# Altium project MM08-FPS-400.PrjPcb
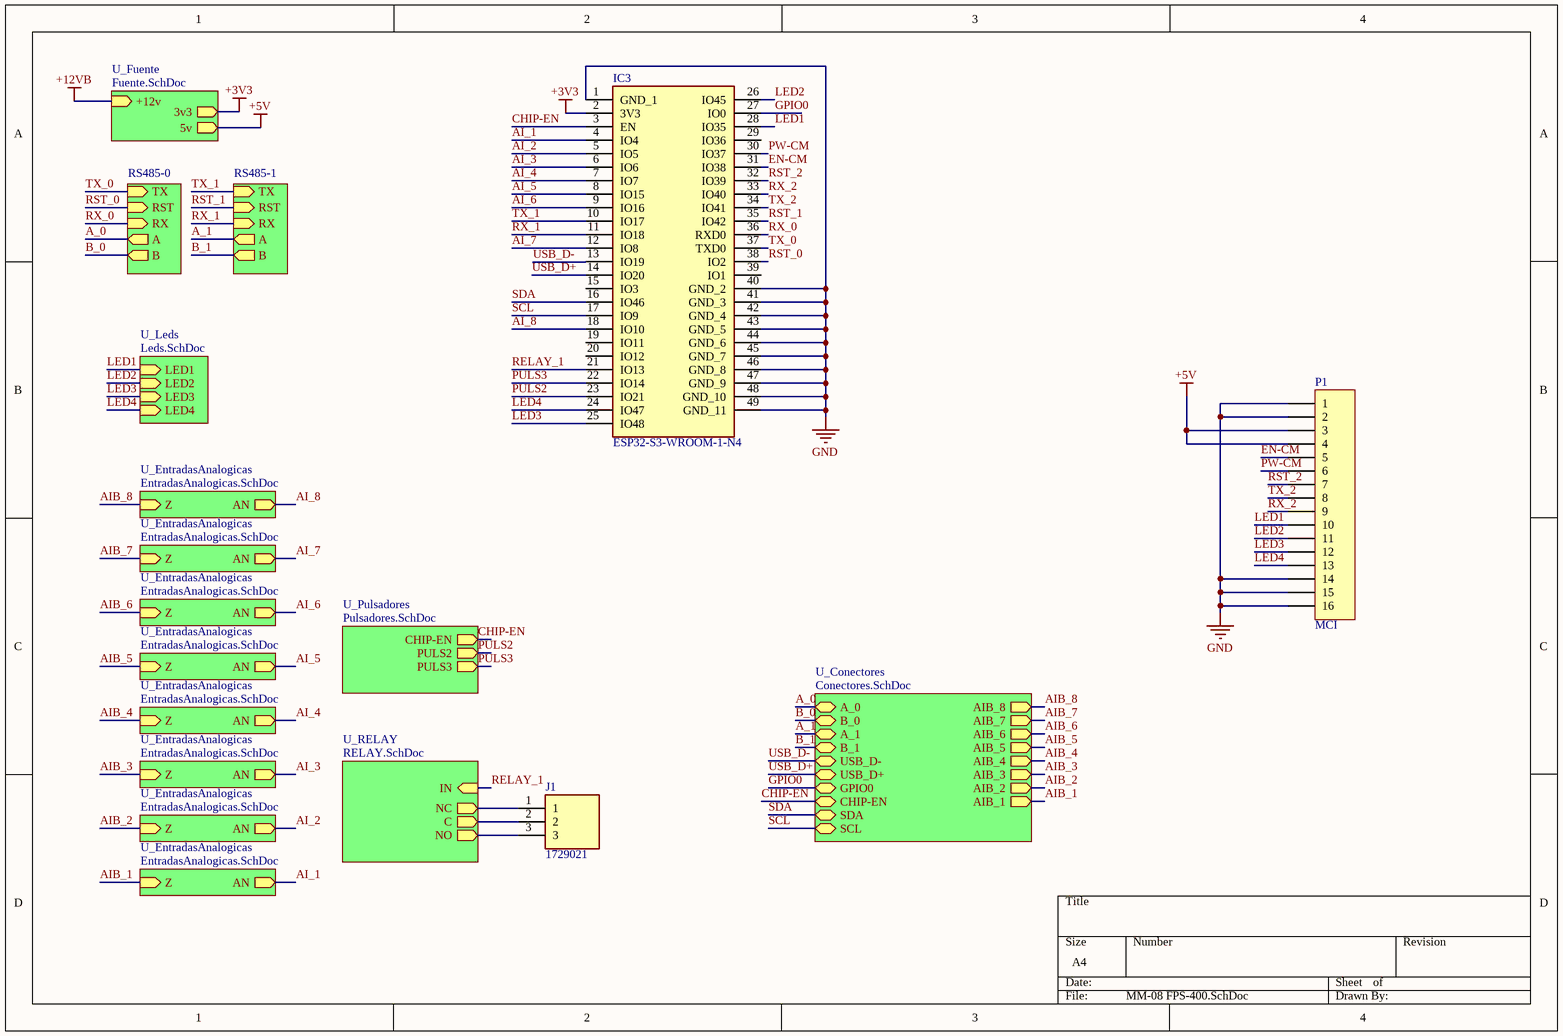
[diagram p0: MM-08 FPS-400.SchDoc]
8 sheets, 81 parts. Net scope: hierarchical (ports join the sheet entries above them; power ports are global).
Board files: PCB-MM-08-FPS-400-CSW.PcbDoc, PCB-MM-08-FPS-400 - CHINA.PcbDoc, PCB-MM-08-FPS-400 - SDW.PcbDoc
Sheets:
  MM-08 FPS-400.SchDoc
    U_Fuente = Fuente.SchDoc
    RS485-1 = RS485.SchDoc
    RS485-0 = RS485.SchDoc
    U_Leds = Leds.SchDoc
    U_Conectores = Conectores.SchDoc
    U_Pulsadores = Pulsadores.SchDoc
    U_EntradasAnalogicas = EntradasAnalogicas.SchDoc
    U_EntradasAnalogicas = EntradasAnalogicas.SchDoc
    U_EntradasAnalogicas = EntradasAnalogicas.SchDoc
    U_EntradasAnalogicas = EntradasAnalogicas.SchDoc
    U_EntradasAnalogicas = EntradasAnalogicas.SchDoc
    U_EntradasAnalogicas = EntradasAnalogicas.SchDoc
    U_EntradasAnalogicas = EntradasAnalogicas.SchDoc
    U_EntradasAnalogicas = EntradasAnalogicas.SchDoc
    U_RELAY = RELAY.SchDoc

## Sheet MM-08 FPS-400.SchDoc
size A4; SheetNumber: 1; SheetTotal: 8

### Parts
IC3  ESP32-S3-WROOM-1-N4  [Model Name]
J1  1729021  [1729021]
P1  MCI  [HDR1X16]

### Sub-sheets
RS485-0 = RS485.SchDoc: RST (in), RX (in), A (out), B (out), TX (in)
RS485-1 = RS485.SchDoc: RST (in), RX (in), A (out), B (out), TX (in)
U_Conectores = Conectores.SchDoc: A_0 (bidir), B_0 (bidir), A_1 (bidir), B_1 (bidir), USB_D- (bidir), USB_D+ (bidir), GPIO0 (bidir), CHIP-EN (bidir), SDA (bidir), SCL (bidir), AIB_3 (out), AIB_2 (out), AIB_6 (out), AIB_7 (out), AIB_5 (out), AIB_4 (out), AIB_1 (out), AIB_8 (out)
U_EntradasAnalogicas = EntradasAnalogicas.SchDoc: AN (out), Z (in)
U_EntradasAnalogicas = EntradasAnalogicas.SchDoc: AN (out), Z (in)
U_EntradasAnalogicas = EntradasAnalogicas.SchDoc: AN (out), Z (in)
U_EntradasAnalogicas = EntradasAnalogicas.SchDoc: AN (out), Z (in)
U_EntradasAnalogicas = EntradasAnalogicas.SchDoc: AN (out), Z (in)
U_EntradasAnalogicas = EntradasAnalogicas.SchDoc: AN (out), Z (in)
U_EntradasAnalogicas = EntradasAnalogicas.SchDoc: AN (out), Z (in)
U_EntradasAnalogicas = EntradasAnalogicas.SchDoc: AN (out), Z (in)
U_Fuente = Fuente.SchDoc: +12v (in), 3v3 (out), 5v (out)
U_Leds = Leds.SchDoc: LED1 (in), LED2 (in), LED3 (in), LED4 (in)
U_Pulsadores = Pulsadores.SchDoc: CHIP-EN (out), PULS2 (out), PULS3 (out)
U_RELAY = RELAY.SchDoc: IN (in), NC (out), C (out), NO (out)

### Nets
+3V3: IC3.2(3V3) ; sheet U_Fuente/3v3
+5V: P1.3 P1.4 ; sheet U_Fuente/5v
GND: IC3.1(GND_1) IC3.40(GND_2) IC3.41(GND_3) IC3.42(GND_4) IC3.43(GND_5) IC3.44(GND_6) IC3.45(GND_7) IC3.46(GND_8) IC3.47(GND_9) IC3.48(GND_10) IC3.49(GND_11) P1.1 P1.2 P1.14 P1.15 P1.16
A_0: sheet RS485-0/A, sheet U_Conectores/A_0
A_1: sheet RS485-1/A, sheet U_Conectores/A_1
AI_1: IC3.4(IO4) ; sheet U_EntradasAnalogicas/AN
AI_2: IC3.5(IO5) ; sheet U_EntradasAnalogicas/AN
AI_3: IC3.6(IO6) ; sheet U_EntradasAnalogicas/AN
AI_4: IC3.7(IO7) ; sheet U_EntradasAnalogicas/AN
AI_5: IC3.8(IO15) ; sheet U_EntradasAnalogicas/AN
AI_6: IC3.9(IO16) ; sheet U_EntradasAnalogicas/AN
AI_7: IC3.12(IO8) ; sheet U_EntradasAnalogicas/AN
AI_8: IC3.18(IO10) ; sheet U_EntradasAnalogicas/AN
AIB_1: sheet U_Conectores/AIB_1, sheet U_EntradasAnalogicas/Z
AIB_2: sheet U_Conectores/AIB_2, sheet U_EntradasAnalogicas/Z
AIB_3: sheet U_Conectores/AIB_3, sheet U_EntradasAnalogicas/Z
AIB_4: sheet U_Conectores/AIB_4, sheet U_EntradasAnalogicas/Z
AIB_5: sheet U_Conectores/AIB_5, sheet U_EntradasAnalogicas/Z
AIB_6: sheet U_Conectores/AIB_6, sheet U_EntradasAnalogicas/Z
AIB_7: sheet U_Conectores/AIB_7, sheet U_EntradasAnalogicas/Z
AIB_8: sheet U_Conectores/AIB_8, sheet U_EntradasAnalogicas/Z
B_0: sheet RS485-0/B, sheet U_Conectores/B_0
B_1: sheet RS485-1/B, sheet U_Conectores/B_1
CHIP-EN: IC3.3(EN) ; sheet U_Conectores/CHIP-EN, sheet U_Pulsadores/CHIP-EN
EN-CM: IC3.31(IO38) P1.5
GPIO0: IC3.27(IO0) ; sheet U_Conectores/GPIO0
LED1: IC3.28(IO35) P1.10 ; sheet U_Leds/LED1
LED2: IC3.26(IO45) P1.11 ; sheet U_Leds/LED2
LED3: IC3.25(IO48) P1.12 ; sheet U_Leds/LED3
LED4: IC3.24(IO47) P1.13 ; sheet U_Leds/LED4
PULS2: IC3.23(IO21) ; sheet U_Pulsadores/PULS2
PULS3: IC3.22(IO14) ; sheet U_Pulsadores/PULS3
PW-CM: IC3.30(IO37) P1.6
RELAY_1: IC3.21(IO13) ; sheet U_RELAY/IN
RST_0: IC3.38(IO2) ; sheet RS485-0/RST
RST_1: IC3.35(IO42) ; sheet RS485-1/RST
RST_2: IC3.32(IO39) P1.7
RX_0: IC3.36(RXD0) ; sheet RS485-0/RX
RX_1: IC3.11(IO18) ; sheet RS485-1/RX
RX_2: IC3.33(IO40) P1.9
SCL: IC3.17(IO9) ; sheet U_Conectores/SCL
SDA: IC3.16(IO46) ; sheet U_Conectores/SDA
TX_0: IC3.37(TXD0) ; sheet RS485-0/TX
TX_1: IC3.10(IO17) ; sheet RS485-1/TX
TX_2: IC3.34(IO41) P1.8
USB_D+: IC3.14(IO20) ; sheet U_Conectores/USB_D+
USB_D-: IC3.13(IO19) ; sheet U_Conectores/USB_D-
NetJ1_1: J1.1 ; sheet U_RELAY/NC
NetJ1_2: J1.2 ; sheet U_RELAY/C
NetJ1_3: J1.3 ; sheet U_RELAY/NO

Not connected (* = marked no-connect by the designer): IC3 15(IO3) 19(IO11) 20(IO12) 29(IO36) 39(IO1)

### Library data of the parts
IC3 = ESP32-S3-WROOM-1-N4: Integrated Circuit; Manufacturer_Name: Espressif Systems; Datasheet Link: https://www.espressif.com/sites/default/files/documentation/esp32-s3-wroom-1_wroom-1u_datasheet_en.pdf; Height: 3.25mm; Manufacturer_Part_Number: ESP32-S3-WROOM-1-N4; Mouser Part Number: 356-ESP32-S3WROOM1N4; Mouser Price/Stock: https://www.mouser.co.uk/ProductDetail/Espressif-Systems/ESP32-S3-WROOM-1-N4?qs=Li%252BoUPsLEnsO%2FkiJOUK0FQ%3D%3D
J1 = 1729021: Connector; Manufacturer_Name: Phoenix Contact; Datasheet Link: http://www.phoenixcontact.com/de/produkte/1729021/pdf; Height: 10.15mm; Manufacturer_Part_Number: 1729021; Mouser Part Number: 651-1729021; Mouser Price/Stock: https://www.mouser.co.uk/ProductDetail/Phoenix-Contact/1729021?qs=zFpBqiaOpnwhKtz3PKBNAQ%3D%3D; Arrow Part Number: 1729021; Arrow Price/Stock: https://www.arrow.com/en/products/1729021/phoenix-contact?region=nac
P1 = Header 16: Header, 16-Pin; LatestRevisionDate: 17-Jul-2002; LatestRevisionNote: Re-released for DXP Platform.; Publisher: Altium Limited

## Sheet Fuente.SchDoc
size A4; SheetNumber: 2; SheetTotal: 8
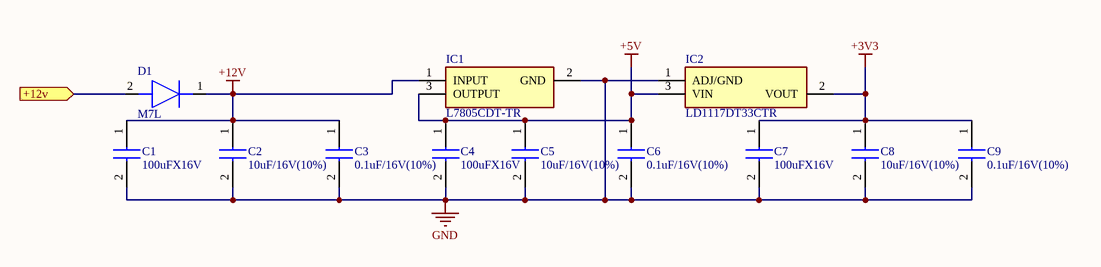
[diagram p1: Fuente.SchDoc]

### Parts
C1  100uFX16V  [CAPAE660X550N]
C2  10uF/16V(10%)  [CAPC3216X100N]
C3  0.1uF/16V(10%)  [CAPC3216X100N]
C4  100uFX16V  [CAPAE660X550N]
C5  10uF/16V(10%)  [CAPC3216X100N]
C6  0.1uF/16V(10%)  [CAPC3216X100N]
C7  100uFX16V  [CAPAE660X550N]
C8  10uF/16V(10%)  [CAPC3216X100N]
C9  0.1uF/16V(10%)  [CAPC3216X100N]
D1  M7L  [DIONM5327X240N]
IC1  L7805CDT-TR  [L7805CDTTR]
IC2  LD1117DT33CTR  [L7805CDTTR]

### Ports
+12v (in)

### Nets
+3V3: C7.1(+) C8.1 C9.1 IC2.2(VOUT)
+5V: C4.1(+) C5.1 C6.1 IC1.3(OUTPUT) IC2.3(VIN)
+12V: C1.1(+) C2.1 C3.1 D1.1(K) IC1.1(INPUT)
+12VB: D1.2(A) ; port +12v
GND: C1.2(-) C2.2 C3.2 C4.2(-) C5.2 C6.2 C7.2(-) C8.2 C9.2 IC1.2(GND) IC2.1(ADJ/GND)

### Library data of the parts
C1 C4 C7 = NACE101M16V6.3X5.5TR13F: 100UFX16V 20%. 6.3x5.4 ELE.RAD.SMD; Manufacturer_Name: NIC Components; Datasheet Link: http://uk.rs-online.com/web/p/products/7379631; Height: 5.5mm; Manufacturer_Part_Number: NACE101M16V6.3X5.5TR13F; Arrow Part Number: NACE101M16V6.3X5.5TR13F; Arrow Price/Stock: https://www.arrow.com/en/products/nace101m16v6.3x5.5tr13f/nic-components
C2 C3 C5 C6 C8 C9 = CL31B104KBCNNNC: 100NFX50V X7R 10% CER.MULT. SMD 1206; Manufacturer_Name: Samsung Electro-Mechanics; Datasheet Link: https://datasheet.datasheetarchive.com/originals/distributors/Datasheets_SAMA/0fdb6a11e020a7299f4d0713dd2bd7ee.pdf; Height: 1mm; Manufacturer_Part_Number: CL31B104KBCNNNC; Mouser Part Number: 187-CL31B104KBCNNNC; Mouser Price/Stock: https://www.mouser.co.uk/ProductDetail/Samsung-Electro-Mechanics/CL31B104KBCNNNC?qs=349EhDEZ59oHABbyGq1iKA%3D%3D; Arrow Part Number: CL31B104KBCNNNC; Arrow Price/Stock: https://www.arrow.com/en/products/cl31b104kbcnnnc/samsung-electro-mechanics?region=nac
D1 = M7L: Diode; Manufacturer_Name: Diotec; Datasheet Link: https://www.mouser.in/ProductDetail/Diotec-Semiconductor/M7L?qs=Wj%2FVkw3K%252BMDMylK9y%2FQg4g%3D%3D; Height: 2.4mm; Manufacturer_Part_Number: M7L; Mouser Part Number: 637-M7L; Mouser Price/Stock: https://www.mouser.co.uk/ProductDetail/Diotec-Semiconductor/M7L?qs=Wj%2FVkw3K%252BMDMylK9y%2FQg4g%3D%3D
IC1 = L7805CDT-TR: Integrated Circuit; Manufacturer_Name: STMicroelectronics; Datasheet Link: https://componentsearchengine.com/Datasheets/2/L7805CDT-TR.pdf; Height: 2.63mm; Manufacturer_Part_Number: L7805CDT-TR; Mouser Part Number: 511-L7805CDT-TR; Mouser Price/Stock: https://www.mouser.co.uk/ProductDetail/STMicroelectronics/L7805CDT-TR?qs=gq%2F78KzUDX67VndS%2FbSB4Q%3D%3D; Arrow Part Number: L7805CDT-TR; Arrow Price/Stock: https://www.arrow.com/en/products/l7805cdt-tr/stmicroelectronics?region=europe
IC2 = LD1117DT33CTR: TO-252-3/DPACK 0.95A 3.3V; Manufacturer_Name: STMicroelectronics; Datasheet Link: https://www.st.com/resource/en/datasheet/ld1117.pdf; Height: 2.48mm; Manufacturer_Part_Number: LD1117DT33CTR; Mouser Part Number: 511-LD1117DT33C-TR; Mouser Price/Stock: https://www.mouser.co.uk/ProductDetail/STMicroelectronics/LD1117DT33CTR?qs=rUxiu3TV3%2FNm%2FOyb7vJzpg%3D%3D; Arrow Part Number: LD1117DT33CTR; Arrow Price/Stock: https://www.arrow.com/en/products/ld1117dt33ctr/stmicroelectronics?region=nac

## Sheet RS485.SchDoc
size A4; SheetNumber: 3; SheetTotal: 8
Used 2 times, as channels RS485-1, RS485-0. Parts and nets are listed once, with the designators drawn on the sheet.
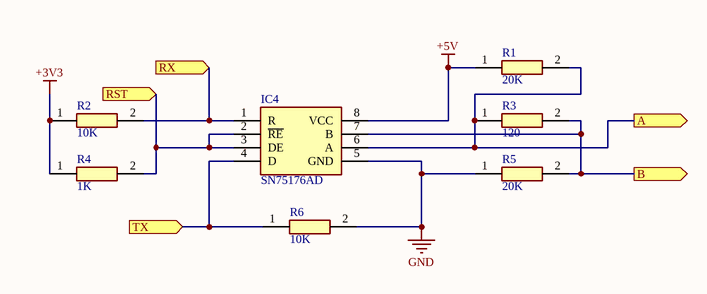
[diagram p2: RS485.SchDoc]

### Parts
IC4  SN75176AD  [SOIC127P600X175-8N]
R1  20K  [RESC3216X75N]
R2  10K  [RESC3216X75N]
R3  120  [RESC3216X75N]
R4  1K  [RESC3216X75N]
R5  20K  [RESC3216X75N]
R6  10K  [RESC3216X75N]

### Ports
A (out), B (out), RST (in), RX (in), TX (in)

### Nets
+3V3: R2.1 R4.1
+5V: IC4.8(VCC) R1.1
GND: IC4.5(GND) R5.1 R6.2
A: IC4.6(A) R1.2 R3.1 ; port A
B: IC4.7(B) R3.2 R5.2 ; port B
RST: IC4.2(~{RE}) IC4.3(DE) R4.2 ; port RST
RX: IC4.1(R) R2.2 ; port RX
TX: IC4.4(D) R6.1 ; port TX

### Channels
RS485-1: designators IC4=IC3_RS485-1 R1=R13_RS485-1 R2=R14_RS485-1 R3=R15_RS485-1 R4=R16_RS485-1 R5=R17_RS485-1 R6=R18_RS485-1; ports A=A_1 B=B_1 RST=RST_1 RX=RX_1 TX=TX_1
RS485-0: designators IC4=IC3_RS485-0 R1=R13_RS485-0 R2=R14_RS485-0 R3=R15_RS485-0 R4=R16_RS485-0 R5=R17_RS485-0 R6=R18_RS485-0; ports A=A_0 B=B_0 RST=RST_0 RX=RX_0 TX=TX_0

### Library data of the parts
IC4 = SN75176AD: Integrated Circuit; Manufacturer_Name: Texas Instruments; Datasheet Link: http://www.ti.com/lit/ds/symlink/sn75176a.pdf; Height: 1.75mm; Manufacturer_Part_Number: SN75176AD; Mouser Part Number: 595-SN75176AD; Mouser Price/Stock: https://www.mouser.co.uk/ProductDetail/Texas-Instruments/SN75176AD?qs=FetendrIl6upbSVFRObzhQ%3D%3D; Arrow Part Number: SN75176AD; Arrow Price/Stock: https://www.arrow.com/en/products/sn75176ad/texas-instruments?region=nac
R1-R6 = CR1206-F_-2R00ELF: Resistor; Manufacturer_Name: Bourns; Manufacturer_Part_Number: CR1206-F/-2R00ELF; Height: 0.75mm; Mouser Part Number: 652-CR1206-F/2R00ELF; Mouser Price/Stock: https://www.mouser.co.uk/ProductDetail/Bourns/CR1206-F-2R00ELF?qs=W%2FMpXkg%252BdQ47Z%2FeZv1nDSg%3D%3D

## Sheet Leds.SchDoc
size A4; SheetNumber: 4; SheetTotal: 8
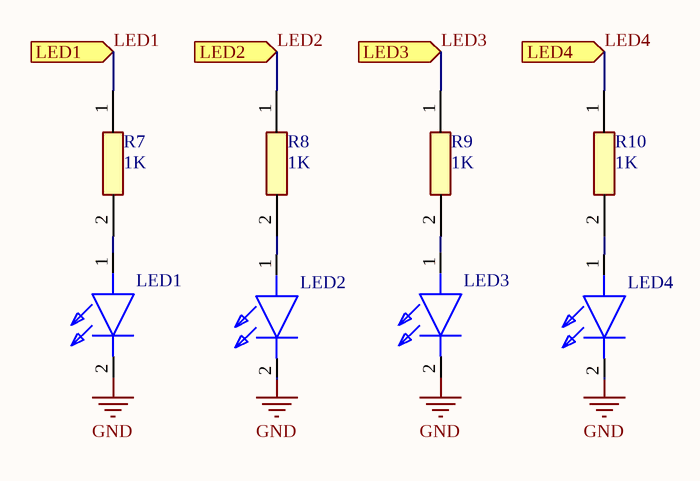
[diagram p3: Leds.SchDoc]

### Parts
LED1  APHCM2012SURCK-F01  [APHCM2012SURCKF01]  (value not drawn)
LED2  APHCM2012SURCK-F01  [APHCM2012SURCKF01]  (value not drawn)
LED3  APHCM2012SURCK-F01  [APHCM2012SURCKF01]  (value not drawn)
LED4  APHCM2012SURCK-F01  [APHCM2012SURCKF01]  (value not drawn)
R7  1K  [RESC3216X75N]
R8  1K  [RESC3216X75N]
R9  1K  [RESC3216X75N]
R10  1K  [RESC3216X75N]

### Ports
LED1 (in), LED2 (in), LED3 (in), LED4 (in)

### Nets
GND: LED1.2(K) LED2.2(K) LED3.2(K) LED4.2(K)
LED1: R7.1 ; port LED1
LED2: R8.1 ; port LED2
LED3: R9.1 ; port LED3
LED4: R10.1 ; port LED4
NetLED1_1: LED1.1(A) R7.2
NetLED2_1: LED2.1(A) R8.2
NetLED3_1: LED3.1(A) R9.2
NetLED4_1: LED4.1(A) R10.2

### Library data of the parts
LED1-LED4 = APHCM2012SURCK-F01: LED; Manufacturer_Name: Kingbright; Datasheet Link: https://componentsearchengine.com/Datasheets/1/APHCM2012SURCK-F01.pdf; Height: 0.5mm; Manufacturer_Part_Number: APHCM2012SURCK-F01; Mouser Part Number: 604-APHCM2012SURCK; Mouser Price/Stock: https://www.mouser.co.uk/ProductDetail/Kingbright/APHCM2012SURCK-F01?qs=qqKal61G0Kww4v8qUa%2Fyzg%3D%3D; Arrow Part Number: APHCM2012SURCK-F01; Arrow Price/Stock: https://www.arrow.com/en/products/aphcm2012surck-f01/kingbright?region=nac
R7-R10 = CR1206-F_-2R00ELF: as R1 on sheet RS485; Height: 0.75mm; Mouser Part Number: 652-CR1206-F/2R00ELF; Mouser Price/Stock: https://www.mouser.co.uk/ProductDetail/Bourns/CR1206-F-2R00ELF?qs=W%2FMpXkg%252BdQ47Z%2FeZv1nDSg%3D%3D

## Sheet Conectores.SchDoc
size A4; SheetNumber: 5; SheetTotal: 8
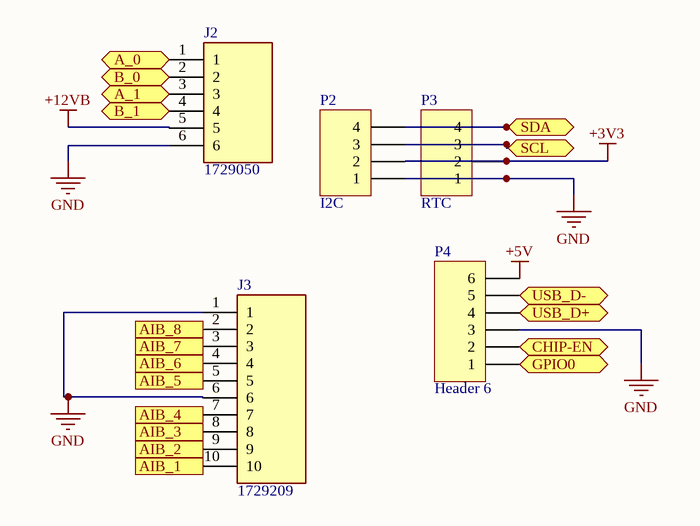
[diagram p4: Conectores.SchDoc]

### Parts
J2  1729050  [1729050]
J3  1729209  [1729209]
P2  I2C  [HDR1X4]
P3  RTC  [HDR1X4]
P4  Header 6  [HDR1X6]

### Ports
A_0 (bidir), A_1 (bidir), AIB_1 (out), AIB_2 (out), AIB_3 (out), AIB_4 (out), AIB_5 (out), AIB_6 (out), AIB_7 (out), AIB_8 (out), B_0 (bidir), B_1 (bidir), CHIP-EN (bidir), GPIO0 (bidir), SCL (bidir), SDA (bidir), USB_D+ (bidir), USB_D- (bidir)

### Nets
+3V3: P2.2 P3.2
+5V: P4.6
+12VB: J2.5
GND: J2.6 J3.1 J3.6 P2.1 P3.1 P4.3
A_0: J2.1 ; port A_0
A_1: J2.3 ; port A_1
AIB_1: J3.10 ; port AIB_1
AIB_2: J3.9 ; port AIB_2
AIB_3: J3.8 ; port AIB_3
AIB_4: J3.7 ; port AIB_4
AIB_5: J3.5 ; port AIB_5
AIB_6: J3.4 ; port AIB_6
AIB_7: J3.3 ; port AIB_7
AIB_8: J3.2 ; port AIB_8
B_0: J2.2 ; port B_0
B_1: J2.4 ; port B_1
CHIP-EN: P4.2 ; port CHIP-EN
GPIO0: P4.1 ; port GPIO0
SCL: P2.3 P3.3 ; port SCL
SDA: P2.4 P3.4 ; port SDA
USB_D+: P4.4 ; port USB_D+
USB_D-: P4.5 ; port USB_D-

### Library data of the parts
J2 = 1729050: Connector; Manufacturer_Name: Phoenix Contact; Datasheet Link: http://www.phoenixcontact.com/de/produkte/1729050/pdf; Height: 10.15mm; Manufacturer_Part_Number: 1729050; Mouser Part Number: 651-1729050; Mouser Price/Stock: https://www.mouser.co.uk/ProductDetail/Phoenix-Contact/1729050?qs=cq3Rj917t3laRrRfXpB0kg%3D%3D; Arrow Part Number: 1729050; Arrow Price/Stock: https://www.arrow.com/en/products/1729050/phoenix-contact?region=nac
J3 = 1729209: Connector; Manufacturer_Name: Phoenix Contact; Datasheet Link: http://www.phoenixcontact.com/de/produkte/1729209/pdf; Height: 10.15mm; Manufacturer_Part_Number: 1729209; Mouser Part Number: 651-1729209; Mouser Price/Stock: https://www.mouser.co.uk/ProductDetail/Phoenix-Contact/1729209?qs=DAHzmYU9cu26iNG3nw7bXQ%3D%3D
P2 P3 = Header 4: Header, 4-Pin; LatestRevisionDate: 17-Jul-2002; LatestRevisionNote: Re-released for DXP Platform.; Publisher: Altium Limited
P4 = Header 6: Header, 6-Pin; LatestRevisionDate: 17-Jul-2002; LatestRevisionNote: Re-released for DXP Platform.; Publisher: Altium Limited

## Sheet Pulsadores.SchDoc
size A4; SheetNumber: 6; SheetTotal: 8
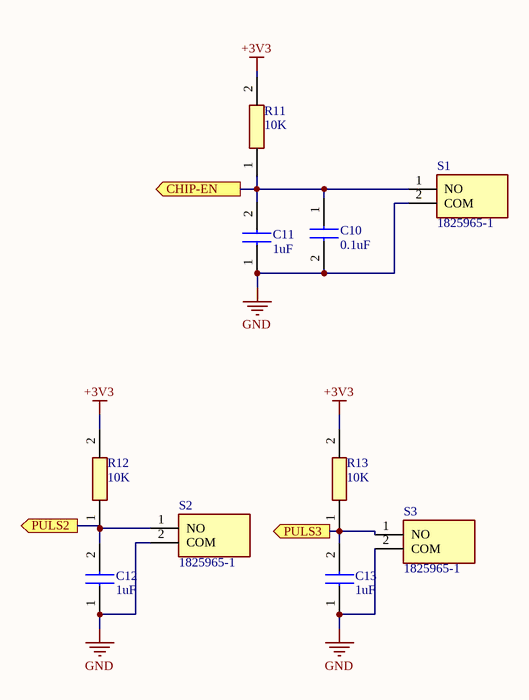
[diagram p5: Pulsadores.SchDoc]

### Parts
C10  0.1uF  [CAPC3216X100N]
C11  1uF  [CAPC3216X100N]
C12  1uF  [CAPC3216X100N]
C13  1uF  [CAPC3216X100N]
R11  10K  [RESC3216X75N]
R12  10K  [RESC3216X75N]
R13  10K  [RESC3216X75N]
S1  1825965-1  [TAC-SWITCH 2CONT. 3,5X6MM]
S2  1825965-1  [TAC-SWITCH 2CONT. 3,5X6MM]
S3  1825965-1  [TAC-SWITCH 2CONT. 3,5X6MM]

### Ports
CHIP-EN (out), PULS2 (out), PULS3 (out)

### Nets
+3V3: R11.2 R12.2 R13.2
GND: C10.2 C11.1 C12.1 C13.1 S1.2(COM) S2.2(COM) S3.2(COM)
CHIP-EN: C10.1 C11.2 R11.1 S1.1(NO) ; port CHIP-EN
PULS2: C12.2 R12.1 S2.1(NO) ; port PULS2
PULS3: C13.2 R13.1 S3.1(NO) ; port PULS3

### Library data of the parts
C10-C13 = CL31B104KBCNNNC: as C2 on sheet Fuente; Datasheet Link: https://datasheet.datasheetarchive.com/originals/distributors/Datasheets_SAMA/0fdb6a11e020a7299f4d0713dd2bd7ee.pdf; Height: 1mm; Manufacturer_Part_Number: CL31B104KBCNNNC; Mouser Part Number: 187-CL31B104KBCNNNC; Mouser Price/Stock: https://www.mouser.co.uk/ProductDetail/Samsung-Electro-Mechanics/CL31B104KBCNNNC?qs=349EhDEZ59oHABbyGq1iKA%3D%3D; Arrow Part Number: CL31B104KBCNNNC; Arrow Price/Stock: https://www.arrow.com/en/products/cl31b104kbcnnnc/samsung-electro-mechanics?region=nac
R11-R13 = CR1206-F_-2R00ELF: as R1 on sheet RS485; Height: 0.75mm; Mouser Part Number: 652-CR1206-F/2R00ELF; Mouser Price/Stock: https://www.mouser.co.uk/ProductDetail/Bourns/CR1206-F-2R00ELF?qs=W%2FMpXkg%252BdQ47Z%2FeZv1nDSg%3D%3D
S1-S3 = 1825965-1: Switch; Manufacturer_Name: TE Connectivity; Datasheet Link: https://www.arrow.com/en/products/1825965-1/te-connectivity; Height: 5mm; Manufacturer_Part_Number: 1825965-1; Arrow Part Number: 1825965-1; Arrow Price/Stock: https://www.arrow.com/en/products/1825965-1/te-connectivity?region=nac

## Sheet EntradasAnalogicas.SchDoc
size A4; SheetNumber: 7; SheetTotal: 8
Used 8 times, as channels U_EntradasAnalogicas, U_EntradasAnalogicas, U_EntradasAnalogicas, U_EntradasAnalogicas, U_EntradasAnalogicas, U_EntradasAnalogicas, U_EntradasAnalogicas, U_EntradasAnalogicas. Parts and nets are listed once, with the designators drawn on the sheet.
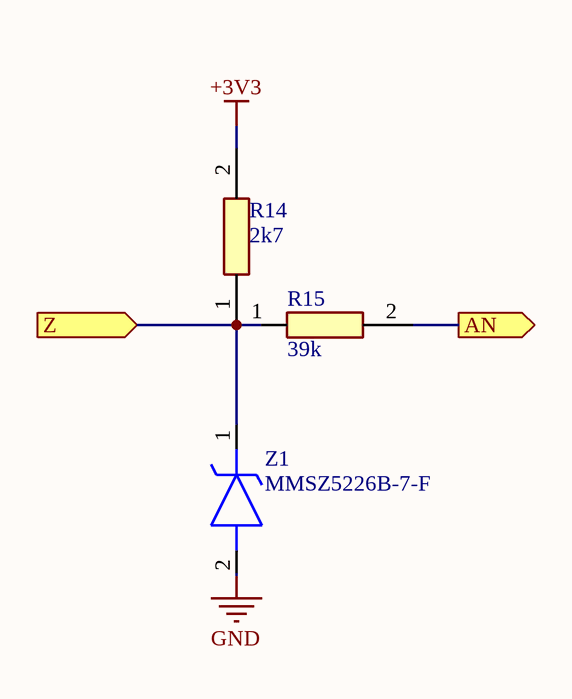
[diagram p6: EntradasAnalogicas.SchDoc]

### Parts
R14  2k7  [RESC3216X75N]
R15  39k  [RESC3216X75N]
Z1  MMSZ5226B-7-F  [MMSZ5226B7F]

### Ports
AN (out), Z (in)

### Nets
+3V3: R14.2
GND: Z1.2(A)
AN: R15.2 ; port AN
Z: R14.1 R15.1 Z1.1(K) ; port Z

### Channels
U_EntradasAnalogicas: designators R14=R?_U_EntradasAnalogicas8#1 R15=R?_U_EntradasAnalogicas8#2 Z1=Z?_U_EntradasAnalogicas8; ports AN=AI_8 Z=AIB_8
U_EntradasAnalogicas: designators R14=R?_U_EntradasAnalogicas7#1 R15=R?_U_EntradasAnalogicas7#2 Z1=Z?_U_EntradasAnalogicas7; ports AN=AI_7 Z=AIB_7
U_EntradasAnalogicas: designators R14=R?_U_EntradasAnalogicas6#1 R15=R?_U_EntradasAnalogicas6#2 Z1=Z?_U_EntradasAnalogicas6; ports AN=AI_6 Z=AIB_6
U_EntradasAnalogicas: designators R14=R?_U_EntradasAnalogicas5#1 R15=R?_U_EntradasAnalogicas5#2 Z1=Z?_U_EntradasAnalogicas5; ports AN=AI_5 Z=AIB_5
U_EntradasAnalogicas: designators R14=R?_U_EntradasAnalogicas4#1 R15=R?_U_EntradasAnalogicas4#2 Z1=Z?_U_EntradasAnalogicas4; ports AN=AI_4 Z=AIB_4
U_EntradasAnalogicas: designators R14=R?_U_EntradasAnalogicas3#1 R15=R?_U_EntradasAnalogicas3#2 Z1=Z?_U_EntradasAnalogicas3; ports AN=AI_3 Z=AIB_3
U_EntradasAnalogicas: designators R14=R?_U_EntradasAnalogicas2#1 R15=R?_U_EntradasAnalogicas2#2 Z1=Z?_U_EntradasAnalogicas2; ports AN=AI_2 Z=AIB_2
U_EntradasAnalogicas: designators R14=R?_U_EntradasAnalogicas1#1 R15=R?_U_EntradasAnalogicas1#2 Z1=Z?_U_EntradasAnalogicas1; ports AN=AI_1 Z=AIB_1

### Library data of the parts
R14 R15 = CR1206-F_-2R00ELF: as R1 on sheet RS485; Height: 0.75mm; Mouser Part Number: 652-CR1206-F/2R00ELF; Mouser Price/Stock: https://www.mouser.co.uk/ProductDetail/Bourns/CR1206-F-2R00ELF?qs=W%2FMpXkg%252BdQ47Z%2FeZv1nDSg%3D%3D
Z1 = MMSZ5226B-7-F: Zener Diode; Manufacturer_Name: Diodes Inc.; Datasheet Link: https://www.arrow.com/en/products/mmsz5226b-7-f/diodes-incorporated; Height: 1.45mm; Manufacturer_Part_Number: MMSZ5226B-7-F; Mouser Part Number: 621-MMSZ5226B-F; Mouser Price/Stock: https://www.mouser.co.uk/ProductDetail/Diodes-Incorporated/MMSZ5226B-7-F?qs=KJYV4z76NkUw6Rc9yJaACw%3D%3D; Arrow Part Number: MMSZ5226B-7-F; Arrow Price/Stock: https://www.arrow.com/en/products/mmsz5226b-7-f/diodes-incorporated?region=europe

## Sheet RELAY.SchDoc
size A4; SheetNumber: 8; SheetTotal: 8
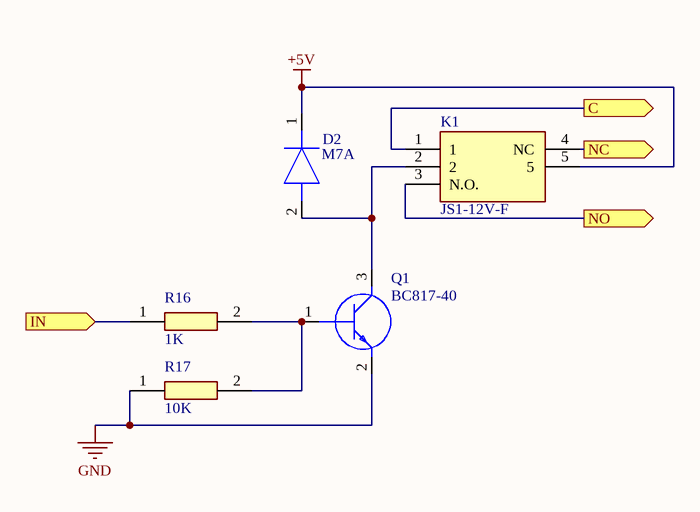
[diagram p7: RELAY.SchDoc]

### Parts
D2  M7A  [DIOM5027X262N]
K1  JS1-12V-F  [JS1-12V-F_1]
Q1  BC817-40  [BC81740215]
R16  1K  [RESC3216X75N]
R17  10K  [RESC3216X75N]

### Ports
C (out), IN (in), NC (out), NO (out)

### Nets
+5V: D2.1(K) K1.5
GND: Q1.2(E) R17.1
RELAY_1: R16.1 ; port IN
NetD2_2: D2.2(A) K1.2 Q1.3(C)
NetJ1_1: K1.4(NC) ; port NC
NetJ1_2: K1.1 ; port C
NetJ1_3: K1.3(N.O.) ; port NO
NetQ1_1: Q1.1(B) R16.2 R17.2

### Library data of the parts
D2 = M7A: Diode; Manufacturer_Name: HY Electronic; Height: 2.62mm; Manufacturer_Part_Number: M7A
K1 = JS1-12V-F: Relay or Contactor; Manufacturer_Name: Panasonic; Datasheet Link: https://datasheet.datasheetarchive.com/originals/distributors/Datasheets-24/DSA-473864.pdf; Manufacturer_Part_Number: JS1-12V-F; Mouser Part Number: 769-JS1-12V-F; Mouser Price/Stock: https://www.mouser.co.uk/ProductDetail/Panasonic-Industrial-Devices/JS1-12V-F?qs=UO%2Fx91QLkSAl%252Bp0dnjREtA%3D%3D; Arrow Part Number: JS1-12V-F; Arrow Price/Stock: https://www.arrow.com/en/products/js1-12v-f/panasonic
Q1 = BC817-40,215: Transistor BJT NPN; Manufacturer_Name: Nexperia; Datasheet Link: https://assets.nexperia.com/documents/data-sheet/BC817_SER.pdf; Height: 1.1mm; Manufacturer_Part_Number: BC817-40,215; Mouser Part Number: 771-BC817-40-T/R; Mouser Price/Stock: https://www.mouser.co.uk/ProductDetail/Nexperia/BC817-40215?qs=me8TqzrmIYU%252B245p8hOLaQ%3D%3D; Arrow Part Number: BC817-40,215; Arrow Price/Stock: https://www.arrow.com/en/products/bc817-40215/nexperia?region=nac
R16 R17 = CR1206-F_-2R00ELF: as R1 on sheet RS485; Height: 0.75mm; Mouser Part Number: 652-CR1206-F/2R00ELF; Mouser Price/Stock: https://www.mouser.co.uk/ProductDetail/Bourns/CR1206-F-2R00ELF?qs=W%2FMpXkg%252BdQ47Z%2FeZv1nDSg%3D%3D

## Nets that join several sheets
+3V3: MM-08 FPS-400 (IC3.2), Fuente (C7.1 C8.1 C9.1 IC2.2), RS485-1 (R14_RS485-1.1 R16_RS485-1.1), RS485-0 (R14_RS485-0.1 R16_RS485-0.1), Conectores (P2.2 P3.2), Pulsadores (R11.2 R12.2 R13.2), U_EntradasAnalogicas (R?_U_EntradasAnalogicas8#1.2), U_EntradasAnalogicas (R?_U_EntradasAnalogicas7#1.2), U_EntradasAnalogicas (R?_U_EntradasAnalogicas6#1.2), U_EntradasAnalogicas (R?_U_EntradasAnalogicas5#1.2), U_EntradasAnalogicas (R?_U_EntradasAnalogicas4#1.2), U_EntradasAnalogicas (R?_U_EntradasAnalogicas3#1.2), U_EntradasAnalogicas (R?_U_EntradasAnalogicas2#1.2), U_EntradasAnalogicas (R?_U_EntradasAnalogicas1#1.2)
+5V: MM-08 FPS-400 (P1.3 P1.4), Fuente (5 pins), RS485-1 (IC3_RS485-1.8 R13_RS485-1.1), RS485-0 (IC3_RS485-0.8 R13_RS485-0.1), Conectores (P4.6), RELAY (D2.1 K1.5)
+12VB: Fuente (D1.2), Conectores (J2.5)
GND: MM-08 FPS-400 (16 pins), Fuente (11 pins), RS485-1 (IC3_RS485-1.5 R17_RS485-1.1 R18_RS485-1.2), RS485-0 (IC3_RS485-0.5 R17_RS485-0.1 R18_RS485-0.2), Leds (LED1.2 LED2.2 LED3.2 LED4.2), Conectores (6 pins), Pulsadores (7 pins), U_EntradasAnalogicas (Z?_U_EntradasAnalogicas8.2), U_EntradasAnalogicas (Z?_U_EntradasAnalogicas7.2), U_EntradasAnalogicas (Z?_U_EntradasAnalogicas6.2), U_EntradasAnalogicas (Z?_U_EntradasAnalogicas5.2), U_EntradasAnalogicas (Z?_U_EntradasAnalogicas4.2), U_EntradasAnalogicas (Z?_U_EntradasAnalogicas3.2), U_EntradasAnalogicas (Z?_U_EntradasAnalogicas2.2), U_EntradasAnalogicas (Z?_U_EntradasAnalogicas1.2), RELAY (Q1.2 R17.1)
A_0: RS485-0 (IC3_RS485-0.6 R13_RS485-0.2 R15_RS485-0.1), Conectores (J2.1)
A_1: RS485-1 (IC3_RS485-1.6 R13_RS485-1.2 R15_RS485-1.1), Conectores (J2.3)
AI_1: MM-08 FPS-400 (IC3.4), U_EntradasAnalogicas (R?_U_EntradasAnalogicas1#2.2)
AI_2: MM-08 FPS-400 (IC3.5), U_EntradasAnalogicas (R?_U_EntradasAnalogicas2#2.2)
AI_3: MM-08 FPS-400 (IC3.6), U_EntradasAnalogicas (R?_U_EntradasAnalogicas3#2.2)
AI_4: MM-08 FPS-400 (IC3.7), U_EntradasAnalogicas (R?_U_EntradasAnalogicas4#2.2)
AI_5: MM-08 FPS-400 (IC3.8), U_EntradasAnalogicas (R?_U_EntradasAnalogicas5#2.2)
AI_6: MM-08 FPS-400 (IC3.9), U_EntradasAnalogicas (R?_U_EntradasAnalogicas6#2.2)
AI_7: MM-08 FPS-400 (IC3.12), U_EntradasAnalogicas (R?_U_EntradasAnalogicas7#2.2)
AI_8: MM-08 FPS-400 (IC3.18), U_EntradasAnalogicas (R?_U_EntradasAnalogicas8#2.2)
AIB_1: Conectores (J3.10), U_EntradasAnalogicas (R?_U_EntradasAnalogicas1#1.1 R?_U_EntradasAnalogicas1#2.1 Z?_U_EntradasAnalogicas1.1)
AIB_2: Conectores (J3.9), U_EntradasAnalogicas (R?_U_EntradasAnalogicas2#1.1 R?_U_EntradasAnalogicas2#2.1 Z?_U_EntradasAnalogicas2.1)
AIB_3: Conectores (J3.8), U_EntradasAnalogicas (R?_U_EntradasAnalogicas3#1.1 R?_U_EntradasAnalogicas3#2.1 Z?_U_EntradasAnalogicas3.1)
AIB_4: Conectores (J3.7), U_EntradasAnalogicas (R?_U_EntradasAnalogicas4#1.1 R?_U_EntradasAnalogicas4#2.1 Z?_U_EntradasAnalogicas4.1)
AIB_5: Conectores (J3.5), U_EntradasAnalogicas (R?_U_EntradasAnalogicas5#1.1 R?_U_EntradasAnalogicas5#2.1 Z?_U_EntradasAnalogicas5.1)
AIB_6: Conectores (J3.4), U_EntradasAnalogicas (R?_U_EntradasAnalogicas6#1.1 R?_U_EntradasAnalogicas6#2.1 Z?_U_EntradasAnalogicas6.1)
AIB_7: Conectores (J3.3), U_EntradasAnalogicas (R?_U_EntradasAnalogicas7#1.1 R?_U_EntradasAnalogicas7#2.1 Z?_U_EntradasAnalogicas7.1)
AIB_8: Conectores (J3.2), U_EntradasAnalogicas (R?_U_EntradasAnalogicas8#1.1 R?_U_EntradasAnalogicas8#2.1 Z?_U_EntradasAnalogicas8.1)
B_0: RS485-0 (IC3_RS485-0.7 R15_RS485-0.2 R17_RS485-0.2), Conectores (J2.2)
B_1: RS485-1 (IC3_RS485-1.7 R15_RS485-1.2 R17_RS485-1.2), Conectores (J2.4)
CHIP-EN: MM-08 FPS-400 (IC3.3), Conectores (P4.2), Pulsadores (C10.1 C11.2 R11.1 S1.1)
GPIO0: MM-08 FPS-400 (IC3.27), Conectores (P4.1)
LED1: MM-08 FPS-400 (IC3.28 P1.10), Leds (R7.1)
LED2: MM-08 FPS-400 (IC3.26 P1.11), Leds (R8.1)
LED3: MM-08 FPS-400 (IC3.25 P1.12), Leds (R9.1)
LED4: MM-08 FPS-400 (IC3.24 P1.13), Leds (R10.1)
NetJ1_1: MM-08 FPS-400 (J1.1), RELAY (K1.4)
NetJ1_2: MM-08 FPS-400 (J1.2), RELAY (K1.1)
NetJ1_3: MM-08 FPS-400 (J1.3), RELAY (K1.3)
PULS2: MM-08 FPS-400 (IC3.23), Pulsadores (C12.2 R12.1 S2.1)
PULS3: MM-08 FPS-400 (IC3.22), Pulsadores (C13.2 R13.1 S3.1)
RELAY_1: MM-08 FPS-400 (IC3.21), RELAY (R16.1)
RST_0: MM-08 FPS-400 (IC3.38), RS485-0 (IC3_RS485-0.2 IC3_RS485-0.3 R16_RS485-0.2)
RST_1: MM-08 FPS-400 (IC3.35), RS485-1 (IC3_RS485-1.2 IC3_RS485-1.3 R16_RS485-1.2)
RX_0: MM-08 FPS-400 (IC3.36), RS485-0 (IC3_RS485-0.1 R14_RS485-0.2)
RX_1: MM-08 FPS-400 (IC3.11), RS485-1 (IC3_RS485-1.1 R14_RS485-1.2)
SCL: MM-08 FPS-400 (IC3.17), Conectores (P2.3 P3.3)
SDA: MM-08 FPS-400 (IC3.16), Conectores (P2.4 P3.4)
TX_0: MM-08 FPS-400 (IC3.37), RS485-0 (IC3_RS485-0.4 R18_RS485-0.1)
TX_1: MM-08 FPS-400 (IC3.10), RS485-1 (IC3_RS485-1.4 R18_RS485-1.1)
USB_D+: MM-08 FPS-400 (IC3.14), Conectores (P4.4)
USB_D-: MM-08 FPS-400 (IC3.13), Conectores (P4.5)